# EAGLE design adapter18 (EAGLE 8.2.2)
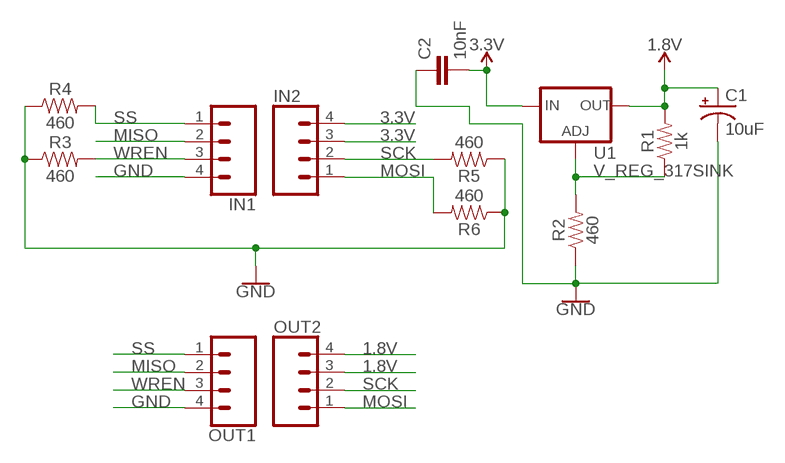
[diagram p0: schematic, sheet 1]

## Parts
C1  10uF  10UF-POLAR-RADIAL-2.5MM-25V-20%  [CPOL-RADIAL-2.5MM-5MM]
C2  10nF  10NF-PTH-10MM-10000V-1-%  [CAP-PTH-10MM]
IN1  CONN_04  [1X04]
IN2  CONN_04  [1X04]
OUT1  CONN_04  [1X04]
OUT2  CONN_04  [1X04]
R1  1k  1KOHM-HORIZ-1/4W-1%  [AXIAL-0.3]
R2  460  1KOHM-HORIZ-1/4W-1%  [AXIAL-0.3]
R3  460  1KOHM-HORIZ-1/4W-1%  [AXIAL-0.3]
R4  460  1KOHM-HORIZ-1/4W-1%  [AXIAL-0.3]
R5  460  1KOHM-HORIZ-1/4W-1%  [AXIAL-0.3]
R6  460  1KOHM-HORIZ-1/4W-1%  [AXIAL-0.3]
U1  V_REG_317SINK  [TO220-ADJ]

## Nets
1.8V: C1.1(+) OUT2.3 OUT2.4 R1.P$2 U1.OUT
3.3V: C2.2 IN2.3 IN2.4 U1.IN
GND: C1.2(-) C2.1 IN1.4 OUT1.4 R2.P$1 R3.P$1 R4.P$1 R5.P$1 R6.P$1
MISO: IN1.2 OUT1.2
MOSI: IN2.1 OUT2.1 R6.P$2
N$1: R1.P$1 R2.P$2 U1.ADJ
SCK: IN2.2 OUT2.2 R5.P$2
SS: IN1.1 OUT1.1 R4.P$2
WREN: IN1.3 OUT1.3 R3.P$2

## Library data of the parts
C1 = SparkFun-Capacitors:10UF-POLAR: 10.0µF polarized capacitors A capacitor is a passive two-terminal electrical component used to store electrical energy temporarily in an electric field.; PROD_ID: CAP-08440
C2 = SparkFun-Capacitors:10NF: 0.01uF/10nF/10,000pF ceramic capacitors A capacitor is a passive two-terminal electrical component used to store electrical energy temporarily in an electric field. CAP-09321; PROD_ID: CAP-09321
IN1 IN2 OUT1 OUT2 = SparkFun-Connectors:CONN_04: Multi connection point. Often used as Generic Header-pin footprint for 0.1 inch spaced/style header connections On any of the 0.1 inch spaced packages, you can populate with these: Break Away Headers - Straight <https://www.sparkfun.com/products/116> (PRT-00116) Break Away Male Headers - Right Angle <https://www.sparkfun.com/products/553> (PRT-00553) Female Headers <https://www.sparkfun.com/products/115> (PRT-00115) Break Away Headers - Machine Pin <https://www.sparkfun.com/products/117> (PRT-00117) Break Away Female Headers - Swiss Machine Pin <https://www.sparkfun.com/products/743> (PRT-00743) For SCREWTERMINALS and SPRING TERMINALS visit here: Screw Terimnals on SparkFun.com <https://www.sparkfun.com/search/results?term=Screw+Terminals> (5mm/3.5mm/2.54mm spacing) This device is also useful as a general connection point to wire up your design to another part of your project. Our various solder wires solder well into these plated through hole pads. Hook-Up Wire - Assortment (Stranded, 22 AWG) <https://www.sparkfun.com/products/11375> (PRT-11375) Hook-Up Wire - Assortment (Solid Core, 22 AWG) <https://www.sparkfun.com/products/11367> (PRT-11367) View the entire wire category on our website here <https://www.sparkfun.com/categories/141> Special notes: Molex polarized connector foot print use with SKU : PRT-08231 with associated crimp pins and housings. 1MM SMD Version SKU: PRT-10208; PROD_ID: CONN-09696
R1 = SparkFun-Resistors:1KOHM: 1kΩ resistor A resistor is a passive two-terminal electrical component that implements electrical resistance as a circuit element. Resistors act to reduce current flow, and, at the same time, act to lower voltage levels within circuits. - Wikipedia; PROD_ID: RES-12182
R2-R6 = SparkFun-Resistors:1KOHM: 1kΩ resistor A resistor is a passive two-terminal electrical component that implements electrical resistance as a circuit element. Resistors act to reduce current flow, and, at the same time, act to lower voltage levels within circuits. - Wikipedia; PROD_ID: RES-12182; VALUE: 1k
U1 = SparkFun-IC-Power:V_REG_317: Voltage Regulator Standard LM317 adjustable voltage regulator. AOI (Adjust Output Input). Google 'LM317 Calculator' for easy to use app to get the two resistor values needed. 240/720 for 5V output. 240/390 for 3.3V output. Spark Fun Electronics SKU : COM-00527

## Board
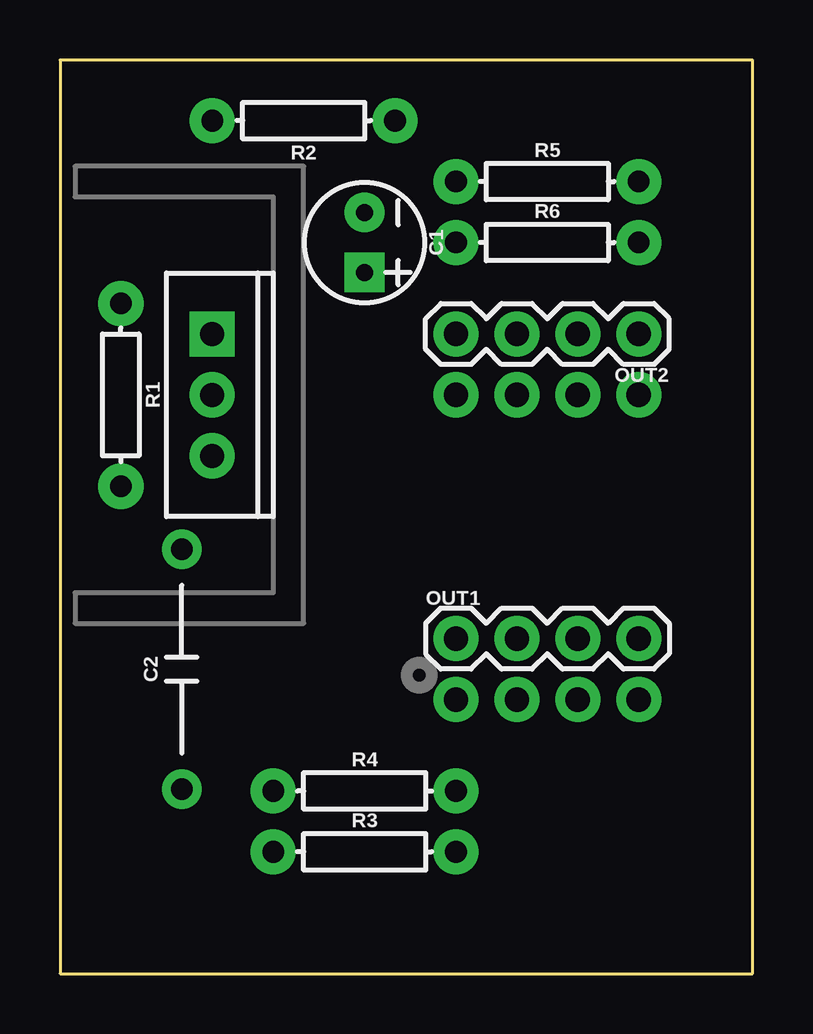
[diagram p1: board, top side]
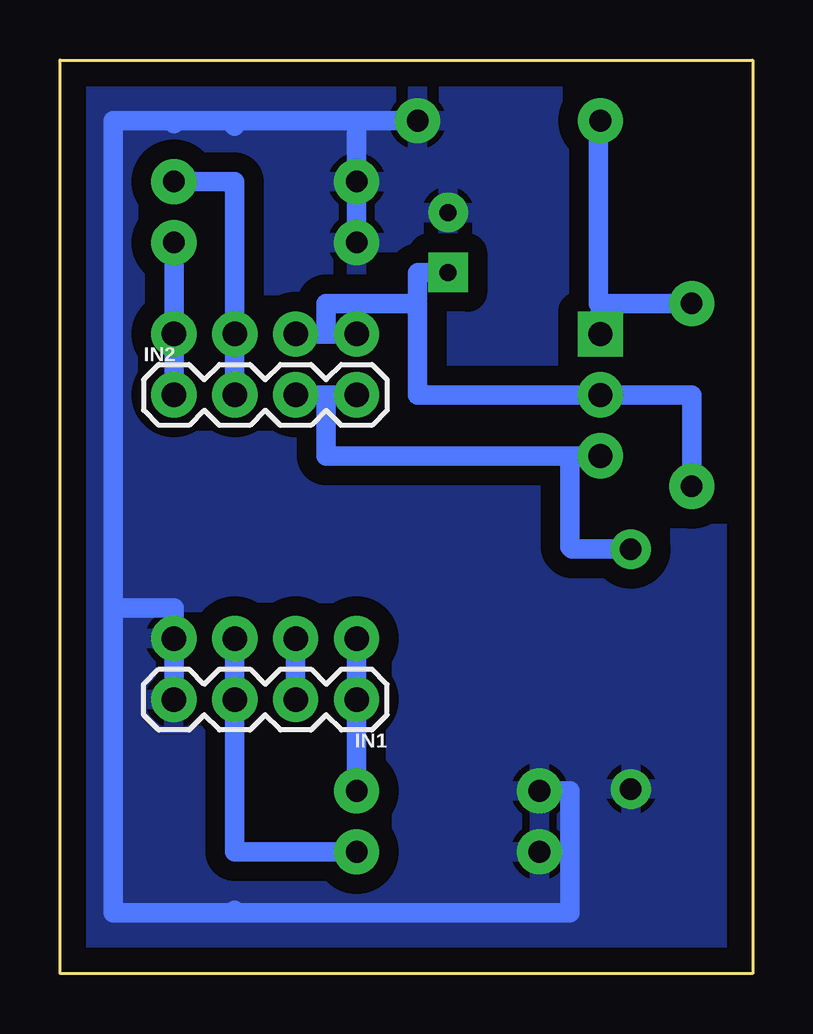
[diagram p2: board, bottom side, seen from below]

Size 28.88 x 38.09 mm. Coordinates in mm from the lower left corner, seen from the top.
Outline: 0,0 28.88,0 28.88,38.09 0,38.09 0,0
Copper layers (1*16): Top 0.035mm / dielectric 1.5mm / Bottom 0.035mm
Design rules "default": minimum track width 6mil, minimum drill 0.35mm, track to track 6mil, track to pad 6mil, pad to pad 6mil, via to via 6mil, smd to smd 6mil, copper to edge 40mil, drill to drill 6mil, minimum pad ring 10mil, minimum via ring 8mil, stop-mask expansion 4mil, vias tented up to drill 0mil, thermal gap 10mil

### Footprints (pad centres in the part's own frame; a part is rotated, then mirrored left to right if it is on the bottom)
CPOL-RADIAL-2.5MM-5MM = drill 0.7 pad 1.651 square: 1 1.25,0 | drill 0.7 pad 1.651: 2 -1.25,0
CAP-PTH-10MM = drill 0.9 pad 1.651: 1 -5,0; 2 5,0
1X04 = drill 1.016 pad 1.88: 1 0,0; 2 2.54,0; 3 5.08,0; 4 7.62,0
AXIAL-0.3 = drill 0.9 pad 1.88: P$1 -3.81,0; P$2 3.81,0
TO220-ADJ = drill 1 pad 1.88 square: ADJ -2.54,0 | drill 1 pad 1.88: IN 2.54,0; OUT 0,0

### Placement (x,y rotation side)
C1  12.7,30.48 270 top
C2  5.08,12.7 90 top
IN1  16.51,11.43 180 bottom
IN2  24.13,24.13 0 bottom
OUT1  16.51,13.97 0 top
OUT2  24.13,26.67 180 top
R1  2.54,24.13 270 top
R2  10.16,35.56 180 top
R3  12.7,5.08 0 top
R4  12.7,7.62 0 top
R5  20.32,33.02 0 top
R6  20.32,30.48 0 top
U1  6.35,24.13 270 top

### Tracks (layer width: path | path; a pad name or v marks a point on that pad's centre or on a via)
1.8V
  Bottom 0.813: OUT2.4 17.78,26.67 | 17.78,26.67 OUT2.3 | R1.P$2 2.54,24.13 U1.OUT 13.97,24.13 13.97,27.94 14.17,27.94 | 17.78,26.67 17.78,27.94 14.17,27.94 | C1.1 13.95,29.23 13.97,29.21 13.97,28.14 14.17,27.94
3.3V
  Bottom 0.813: 17.82,24.13 IN2.4 | 17.82,24.13 IN2.3 | 17.82,24.13 17.78,24.09 17.78,21.59 7.3,21.59 | 7.3,21.59 U1.IN | C2.2 7.54,17.7 7.62,17.78 7.62,21.27 7.3,21.59
GND
  Bottom 0.813: IN1.4 OUT1.4 24.13,15.24 26.56,15.24 26.67,15.13 | 21.81,35.56 24.25,35.56 | 21.81,35.56 16.59,35.56 | 24.25,35.56 26.67,35.56 26.67,15.13 | 26.67,15.13 26.67,2.54 21.7,2.54 | 21.59,2.65 21.7,2.54 | 24.13,35.44 24.25,35.56 | 21.59,35.34 21.81,35.56 | 7.62,4.83 7.62,2.54 21.7,2.54 | 7.62,4.83 7.62,7.62 R4.P$1 | R3.P$1 7.87,5.08 7.62,4.83 | 16.59,35.56 16.51,35.48 R5.P$1 R6.P$1 | 16.59,35.56 R2.P$1
  pour Bottom (isolate 0.813): 0,38.1 29.21,38.1 29.21,0 0,0
MISO
  Bottom 0.813: IN1.2 OUT1.2
MOSI
  Bottom 0.813: IN2.1 OUT2.1 R6.P$2
N$1
  Bottom 0.813: R1.P$1 6.42,27.94 | U1.ADJ 6.35,27.87 6.42,27.94 | 6.42,27.94 6.42,35.49 R2.P$2
SCK
  Bottom 0.813: IN2.2 OUT2.2 21.59,33.02 R5.P$2
SS
  Bottom 0.813: OUT1.1 IN1.1 R4.P$2
WREN
  Bottom 0.813: OUT1.3 IN1.3 21.59,5.08 R3.P$2

### Text on the board
tDocu: FlashProgrammer / 1.8v adapter